# EAGLE schematic Nusbio 2-MCU-EX (EAGLE 7.6.0)
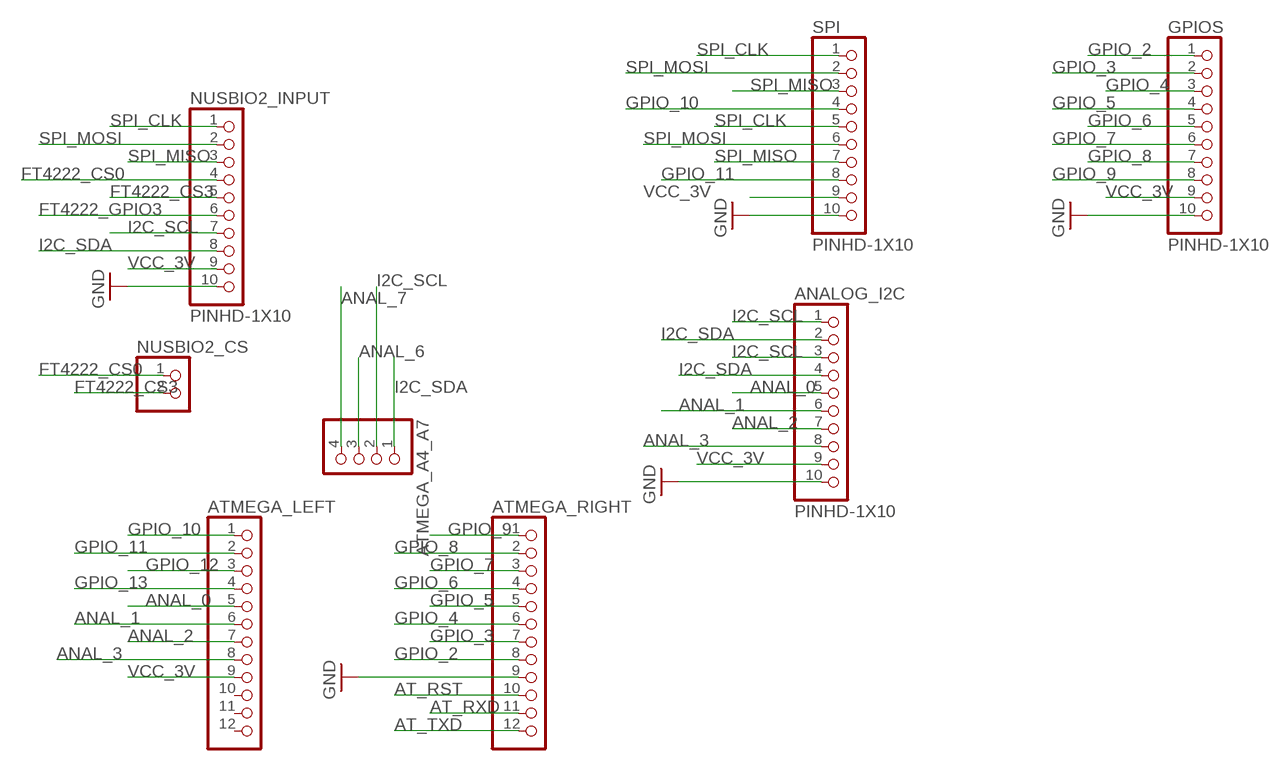
[diagram p0: schematic, sheet 1]

## Parts
ANALOG_I2C  PINHD-1X10  [1X10-BIG]
ATMEGA_A4_A7  PINHD-1X4  [1X04]
ATMEGA_LEFT  PINHD-1X12  [1X12]
ATMEGA_RIGHT  PINHD-1X12  [1X12]
GPIOS  PINHD-1X10  [1X10-BIG]
NUSBIO2_CS  PINHD-1X2  [1X02]
NUSBIO2_INPUT  PINHD-1X10  [1X10-BIG]
SPI  PINHD-1X10  [1X10-BIG]

## Nets
ANAL_0: ANALOG_I2C.5 ATMEGA_LEFT.5
ANAL_1: ANALOG_I2C.6 ATMEGA_LEFT.6
ANAL_2: ANALOG_I2C.7 ATMEGA_LEFT.7
ANAL_3: ANALOG_I2C.8 ATMEGA_LEFT.8
ANAL_6: ATMEGA_A4_A7.3
ANAL_7: ATMEGA_A4_A7.4
AT_RST: ATMEGA_RIGHT.10
AT_RXD: ATMEGA_RIGHT.11
AT_TXD: ATMEGA_RIGHT.12
FT4222_CS0: NUSBIO2_CS.1 NUSBIO2_INPUT.4
FT4222_CS3: NUSBIO2_CS.2 NUSBIO2_INPUT.5
FT4222_GPIO3: NUSBIO2_INPUT.6
GND: ANALOG_I2C.10 ATMEGA_RIGHT.9 GPIOS.10 NUSBIO2_INPUT.10 SPI.10
GPIO_2: ATMEGA_RIGHT.8 GPIOS.1
GPIO_3: ATMEGA_RIGHT.7 GPIOS.2
GPIO_4: ATMEGA_RIGHT.6 GPIOS.3
GPIO_5: ATMEGA_RIGHT.5 GPIOS.4
GPIO_6: ATMEGA_RIGHT.4 GPIOS.5
GPIO_7: ATMEGA_RIGHT.3 GPIOS.6
GPIO_8: ATMEGA_RIGHT.2 GPIOS.7
GPIO_9: ATMEGA_RIGHT.1 GPIOS.8
GPIO_10: ATMEGA_LEFT.1 SPI.4
GPIO_11: ATMEGA_LEFT.2 SPI.8
GPIO_12: ATMEGA_LEFT.3
GPIO_13: ATMEGA_LEFT.4
I2C_SCL: ANALOG_I2C.1 ANALOG_I2C.3 ATMEGA_A4_A7.2 NUSBIO2_INPUT.7
I2C_SDA: ANALOG_I2C.2 ANALOG_I2C.4 ATMEGA_A4_A7.1 NUSBIO2_INPUT.8
SPI_CLK: NUSBIO2_INPUT.1 SPI.1 SPI.5
SPI_MISO: NUSBIO2_INPUT.3 SPI.3 SPI.7
SPI_MOSI: NUSBIO2_INPUT.2 SPI.2 SPI.6
VCC_3V: ANALOG_I2C.9 ATMEGA_LEFT.9 GPIOS.9 NUSBIO2_INPUT.9 SPI.9
Unconnected: ATMEGA_LEFT.10 ATMEGA_LEFT.11 ATMEGA_LEFT.12

## Library data of the parts
ANALOG_I2C GPIOS NUSBIO2_INPUT SPI = adafruit:PINHD-1X10: Pin header 1x10 0.1" spacing With round pins
ATMEGA_A4_A7 = pinhead:PINHD-1X4: PIN HEADER
ATMEGA_LEFT ATMEGA_RIGHT = adafruit:PINHD-1X12: PIN HEADER
NUSBIO2_CS = pinhead:PINHD-1X2: PIN HEADER